# EasyEDA schematic schematic.json
TITLE: Sheet_1; REV: 1.0; Date: 2024-10-11; Sheet: 1/1; Drawn By: topotamadre1811; Company: Your Company
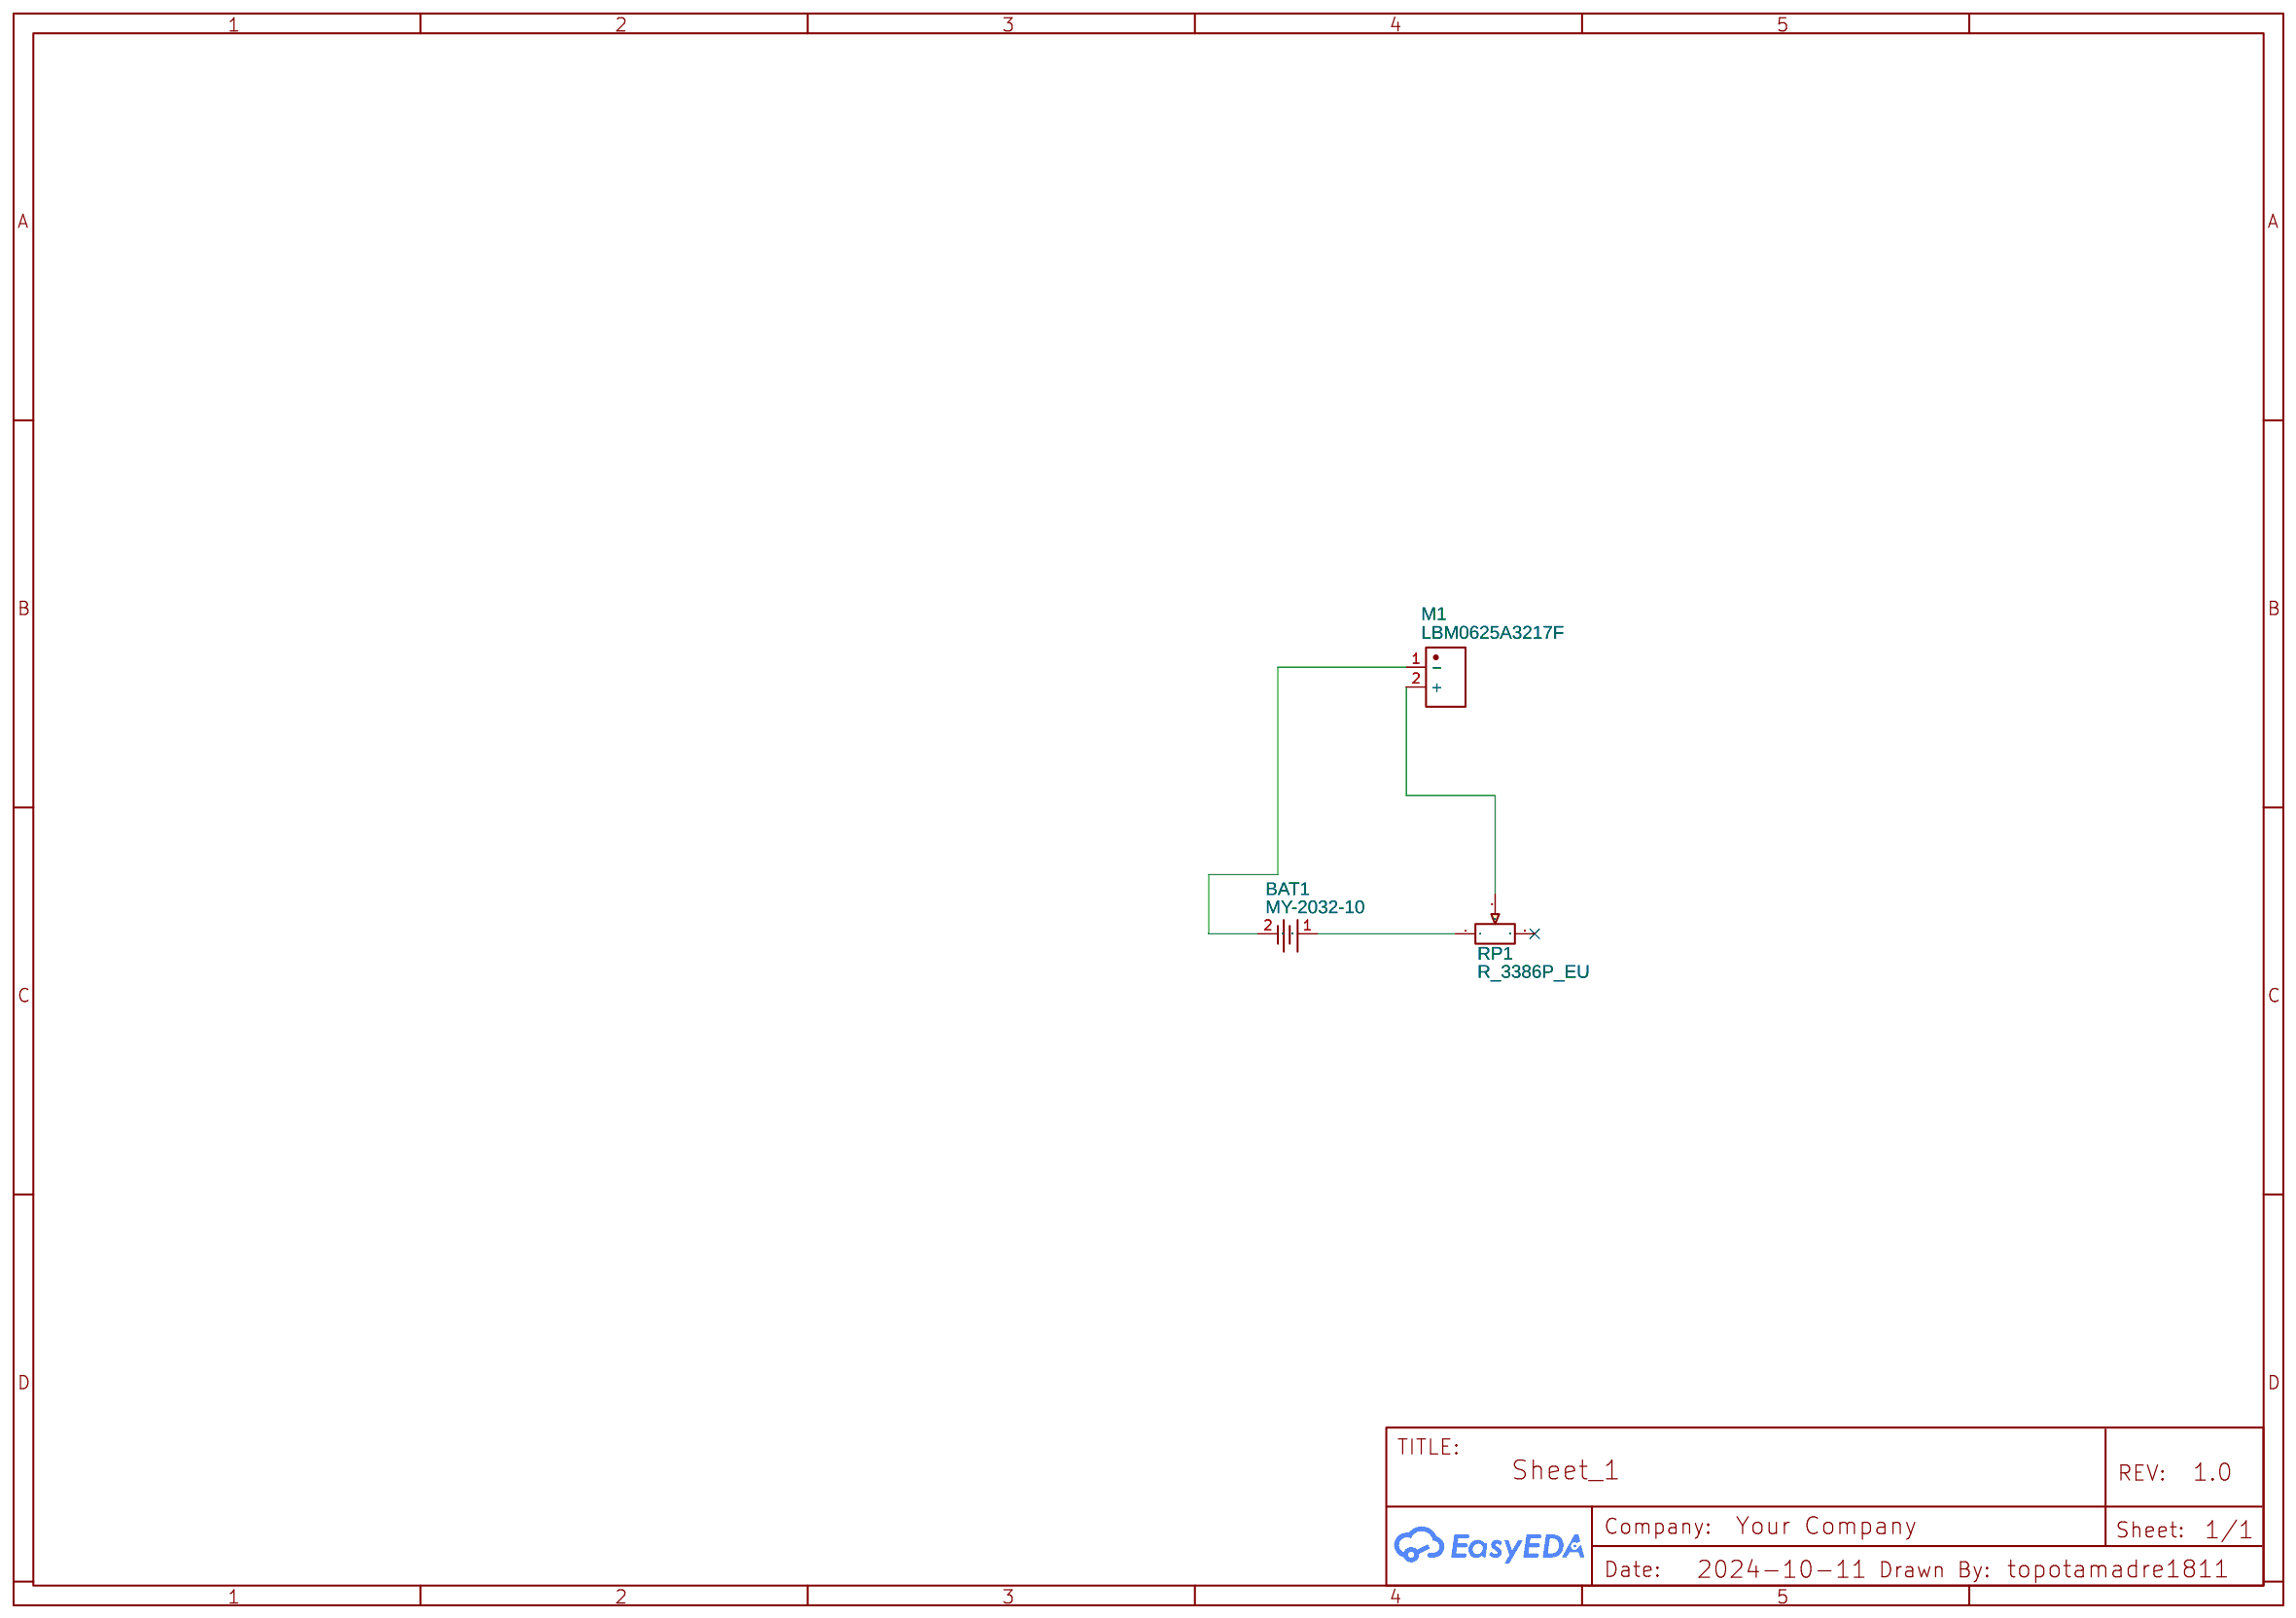
[diagram p0: schematic sheet]

## Parts
BAT1  MY-2032-10  [BATTERY-SMD-MY-2032]
M1  LBM0625A3217F  [SMD_LBM0625A3217F]
RP1  R_3386P_EU  [RES-ADJ-TH_3386P]

## Library data of the parts
BAT1 = MY-2032-10: Contributor: lcsc; Supplier: LCSC; Supplier Part: C964827; Manufacturer: MYOUNG(美阳); JLCPCB Part Class: Extended Part
M1 = LBM0625A3217F: Supplier: LCSC; Supplier Part: C2942345; Manufacturer: LEADER(立得); JLCPCB Part Class: Extended Part
RP1 = R_3386P_EU: Supplier: LCSC; Contributor: LCEDA_Lib; Value(Ω): 10K

## Nets
Net-(BAT1-1): BAT1.1(BAT+) RP1.1
Net-(BAT1-2): BAT1.2(BAT-) M1.1(-)
Net-(M1-2): M1.2(+) RP1.2

Not connected (* = marked no-connect by the designer): RP1 3*
